# Altium schematic sheet DisplayPort.SchDoc
size A4; SheetNumber: 2; SheetTotal: 4
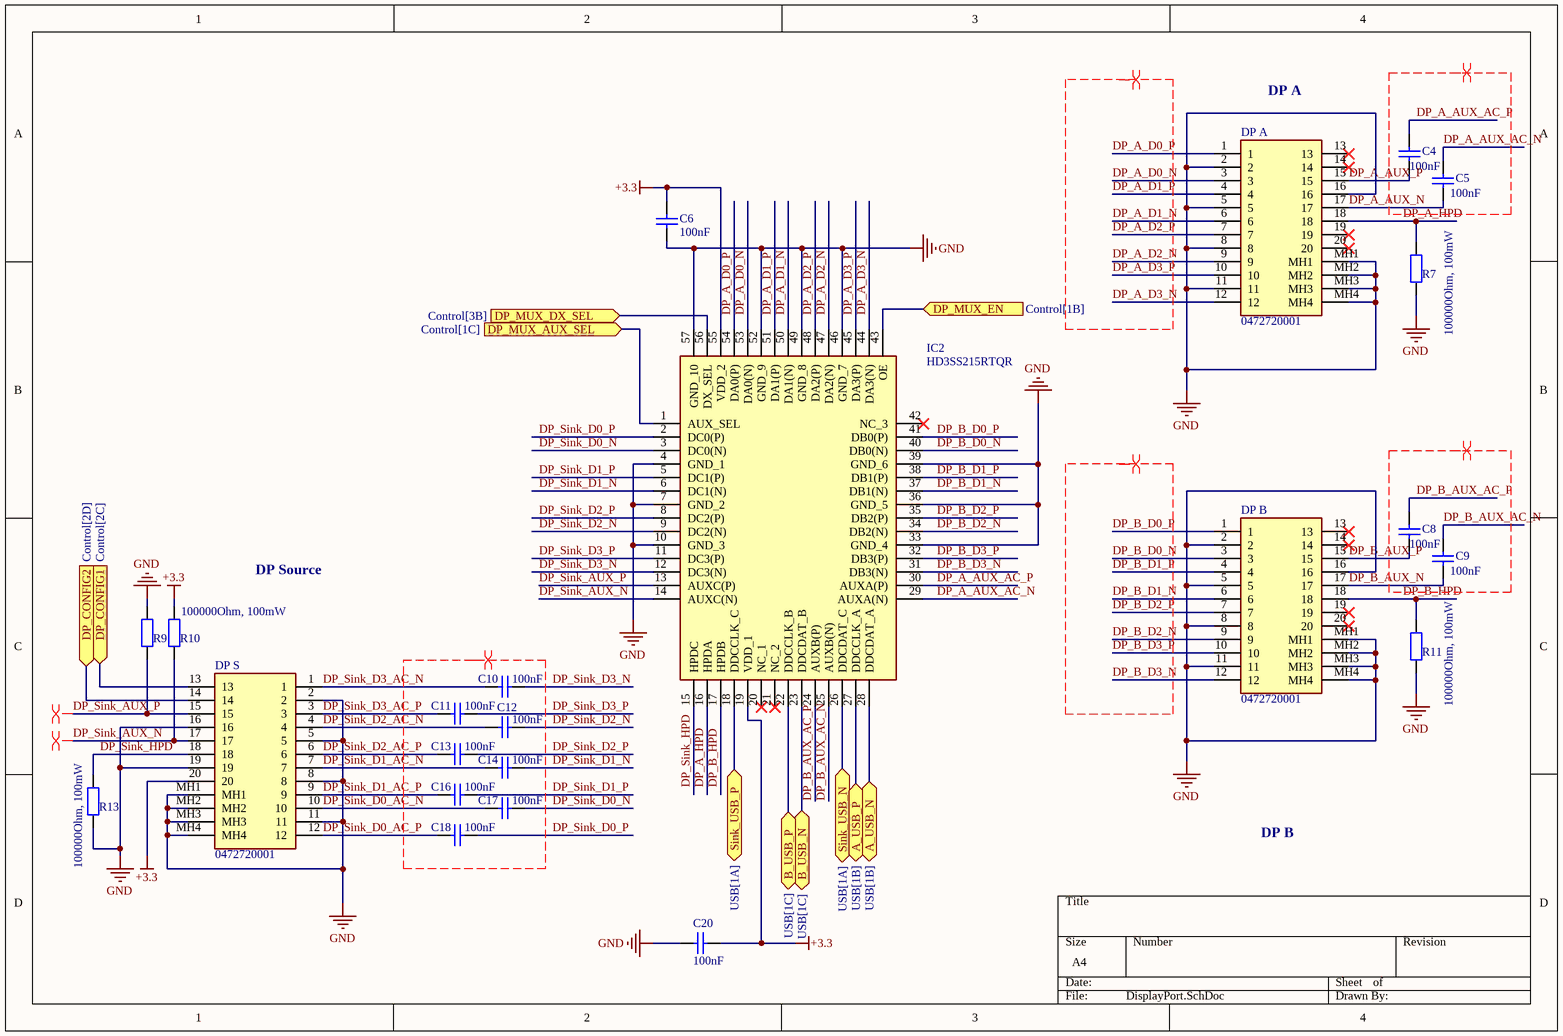
[diagram p0: DisplayPort.SchDoc]

## Parts
C4  Capacitance: 100nF  [WCAP-CSGP_0402_L1W0.5H0.5]  (hidden comment: 885012205037)
C5  Capacitance: 100nF  [WCAP-CSGP_0402_L1W0.5H0.5]  (hidden comment: 885012205037)
C6  Capacitance: 100nF  [WCAP-CSGP_0402_L1W0.5H0.5]  (hidden comment: 885012205037)
C8  Capacitance: 100nF  [WCAP-CSGP_0402_L1W0.5H0.5]  (hidden comment: 885012205037)
C9  Capacitance: 100nF  [WCAP-CSGP_0402_L1W0.5H0.5]  (hidden comment: 885012205037)
C10  Capacitance: 100nF  [WCAP-CSGP_0402_L1W0.5H0.5]  (hidden comment: 885012205037)
C11  Capacitance: 100nF  [WCAP-CSGP_0402_L1W0.5H0.5]  (hidden comment: 885012205037)
C12  Capacitance: 100nF  [WCAP-CSGP_0402_L1W0.5H0.5]  (hidden comment: 885012205037)
C13  Capacitance: 100nF  [WCAP-CSGP_0402_L1W0.5H0.5]  (hidden comment: 885012205037)
C14  Capacitance: 100nF  [WCAP-CSGP_0402_L1W0.5H0.5]  (hidden comment: 885012205037)
C16  Capacitance: 100nF  [WCAP-CSGP_0402_L1W0.5H0.5]  (hidden comment: 885012205037)
C17  Capacitance: 100nF  [WCAP-CSGP_0402_L1W0.5H0.5]  (hidden comment: 885012205037)
C18  Capacitance: 100nF  [WCAP-CSGP_0402_L1W0.5H0.5]  (hidden comment: 885012205037)
C20  Capacitance: 100nF  [WCAP-CSGP_0402_L1W0.5H0.5]  (hidden comment: 885012205037)
DP_A  0472720001  [0472720001]
DP_B  0472720001  [0472720001]
DP_S  0472720001  [0472720001]
IC2  HD3SS215RTQR  [QFN50P800X800X100-57N-D]
R7  100000Ohm, 100mW  [WRIS-RSKS_0402]
R9  100000Ohm, 100mW  [WRIS-RSKS_0402]  (value not drawn)
R10  100000Ohm, 100mW  [WRIS-RSKS_0402]
R11  100000Ohm, 100mW  [WRIS-RSKS_0402]
R13  100000Ohm, 100mW  [WRIS-RSKS_0402]

## Ports
A_USB_N (bidir, see USB[1B]), A_USB_P (bidir, see USB[1B]), B_USB_N (bidir, see USB[1C]), B_USB_P (bidir, see USB[1C]), DP_CONFIG1 (in, see Control[2C]), DP_CONFIG2 (in, see Control[2D]), DP_MUX_AUX_SEL (in, see Control[1C]), DP_MUX_DX_SEL (in, see Control[3B]), DP_MUX_EN (in, see Control[1B]), Sink_USB_N (bidir, see USB[1A]), Sink_USB_P (bidir, see USB[1A])

## Nets
+3.3: C6.1 C20.2 DP_S.20 IC2.19(VDD_1) IC2.55(VDD_2) R10.2
GND: C6.2 C20.1 DP_A.2 DP_A.5 DP_A.8 DP_A.11 DP_A.16 DP_A.MH1 DP_A.MH2 DP_A.MH3 DP_A.MH4 DP_B.2 DP_B.5 DP_B.8 DP_B.11 DP_B.16 DP_B.MH1 DP_B.MH2 DP_B.MH3 DP_B.MH4 DP_S.2 DP_S.5 DP_S.8 DP_S.11 DP_S.16 DP_S.19 DP_S.MH1 DP_S.MH2 DP_S.MH3 DP_S.MH4 IC2.4(GND_1) IC2.7(GND_2) IC2.10(GND_3) IC2.33(GND_4) IC2.36(GND_5) IC2.39(GND_6) IC2.46(GND_7) IC2.49(GND_8) IC2.52(GND_9) IC2.57(GND_10) R7.1 R9.2 R11.1 R13.1
A_USB_N: IC2.28(DDCDAT_A) ; port A_USB_N
A_USB_P: IC2.27(DDCCLK_A) ; port A_USB_P
B_USB_N: IC2.23(DDCDAT_B) ; port B_USB_N
B_USB_P: IC2.22(DDCCLK_B) ; port B_USB_P
DP_A_AUX_AC_N: C5.2 IC2.29(AUXA(N))
DP_A_AUX_AC_P: C4.2 IC2.30(AUXA(P))
DP_A_AUX_N: C5.1 DP_A.17
DP_A_AUX_P: C4.1 DP_A.15
DP_A_D0_N: DP_A.3 IC2.53(DA0(N))
DP_A_D0_P: DP_A.1 IC2.54(DA0(P))
DP_A_D1_N: DP_A.6 IC2.50(DA1(N))
DP_A_D1_P: DP_A.4 IC2.51(DA1(P))
DP_A_D2_N: DP_A.9 IC2.47(DA2(N))
DP_A_D2_P: DP_A.7 IC2.48(DA2(P))
DP_A_D3_N: DP_A.12 IC2.44(DA3(N))
DP_A_D3_P: DP_A.10 IC2.45(DA3(P))
DP_A_HPD: DP_A.18 IC2.16(HPDA) R7.2
DP_B_AUX_AC_N: C9.2 IC2.25(AUXB(N))
DP_B_AUX_AC_P: C8.2 IC2.24(AUXB(P))
DP_B_AUX_N: C9.1 DP_B.17
DP_B_AUX_P: C8.1 DP_B.15
DP_B_D0_N: DP_B.3 IC2.40(DB0(N))
DP_B_D0_P: DP_B.1 IC2.41(DB0(P))
DP_B_D1_N: DP_B.6 IC2.37(DB1(N))
DP_B_D1_P: DP_B.4 IC2.38(DB1(P))
DP_B_D2_N: DP_B.9 IC2.34(DB2(N))
DP_B_D2_P: DP_B.7 IC2.35(DB2(P))
DP_B_D3_N: DP_B.12 IC2.31(DB3(N))
DP_B_D3_P: DP_B.10 IC2.32(DB3(P))
DP_B_HPD: DP_B.18 IC2.17(HPDB) R11.2
DP_CONFIG1: DP_S.13 ; port DP_CONFIG1
DP_CONFIG2: DP_S.14 ; port DP_CONFIG2
DP_MUX_AUX_SEL: IC2.1(AUX_SEL) ; port DP_MUX_AUX_SEL
DP_MUX_DX_SEL: IC2.56(DX_SEL) ; port DP_MUX_DX_SEL
DP_MUX_EN: IC2.43(OE) ; port DP_MUX_EN
DP_Sink_AUX_N: DP_S.17 IC2.14(AUXC(N)) R10.1
DP_Sink_AUX_P: DP_S.15 IC2.13(AUXC(P)) R9.1
DP_Sink_D0_AC_N: C17.2 DP_S.10
DP_Sink_D0_AC_P: C18.2 DP_S.12
DP_Sink_D0_N: C17.1 IC2.3(DC0(N))
DP_Sink_D0_P: C18.1 IC2.2(DC0(P))
DP_Sink_D1_AC_N: C14.2 DP_S.7
DP_Sink_D1_AC_P: C16.2 DP_S.9
DP_Sink_D1_N: C14.1 IC2.6(DC1(N))
DP_Sink_D1_P: C16.1 IC2.5(DC1(P))
DP_Sink_D2_AC_N: C12.2 DP_S.4
DP_Sink_D2_AC_P: C13.2 DP_S.6
DP_Sink_D2_N: C12.1 IC2.9(DC2(N))
DP_Sink_D2_P: C13.1 IC2.8(DC2(P))
DP_Sink_D3_AC_N: C10.2 DP_S.1
DP_Sink_D3_AC_P: C11.2 DP_S.3
DP_Sink_D3_N: C10.1 IC2.12(DC3(N))
DP_Sink_D3_P: C11.1 IC2.11(DC3(P))
DP_Sink_HPD: DP_S.18 IC2.15(HPDC) R13.2
Sink_USB_N: IC2.26(DDCDAT_C) ; port Sink_USB_N
Sink_USB_P: IC2.18(DDCCLK_C) ; port Sink_USB_P

Not connected (* = marked no-connect by the designer): DP_A 13* 14* 19* 20*; DP_B 13* 14* 19* 20*; IC2 20(NC_1)* 21(NC_2)* 42(NC_3)*

## Layout directives
differential pair; differential pair class Z100: (no net found under the mark), DP_A_AUX_AC_N, DP_A_AUX_AC_P, DP_A_D0_N, DP_A_D0_P, DP_A_D1_N, DP_A_D1_P, DP_A_D2_N, DP_A_D2_P, DP_A_D3_N, DP_A_D3_P, DP_B_AUX_AC_N, DP_B_AUX_AC_P, DP_B_D0_N, DP_B_D0_P, DP_B_D1_N, DP_B_D1_P, DP_B_D2_N, DP_B_D2_P, DP_B_D3_N, DP_B_D3_P, DP_Sink_AUX_N, DP_Sink_AUX_P

## Notes on the sheet
- DP A
- DP Source
- DP B

## Library data of the parts
C4-C6 C8-C14 C16-C18 C20 = CMP-207839-000001-2: CAP CER 0.1UF 16V X7R 0402; NexarPartId: 53703175; Material: Ceramic; Tolerance: 10%; Insulation Resistance: 5GΩ; Dielectric: X7R; Case/Package: 0402; Voltage Rating (DC): 16V; Max Operating Temperature: 125°C; Width: 500µm; Packaging: Tape & Reel (TR); Height: 500µm; Min Operating Temperature: -55°C; REACH SVHC: Unknown; RoHS: Compliant; Thickness: 558.8µm; Mount: Surface Mount; Voltage Rating: 16V; Case Code (Imperial): 0402; Length: 1mm; Case Code (Metric): 1005
DP_A DP_B DP_S = 0472720001: Connector; Manufacturer_Name: Molex; Datasheet Link: http://www.molex.com/pdm_docs/sd/472720001_sd.pdf; Height: 6.9mm; Manufacturer_Part_Number: 0472720001; Mouser Part Number: N/A; Mouser Price/Stock: https://www.mouser.co.uk/ProductDetail/Molex/0472720001?qs=PBcRNPEHKsrarbeLf7n8sg%3D%3D; Arrow Part Number: 0472720001; Arrow Price/Stock: https://www.arrow.com/en/products/0472720001/molex?region=europe
IC2 = HD3SS215RTQR: Integrated Circuit; Manufacturer_Name: Texas Instruments; Datasheet Link: http://www.ti.com/lit/gpn/hd3ss215; Height: 1mm; Manufacturer_Part_Number: HD3SS215RTQR; Mouser Part Number: 595-HD3SS215RTQR; Mouser Price/Stock: https://www.mouser.co.uk/ProductDetail/Texas-Instruments/HD3SS215RTQR?qs=7z%252BmIopC6%2FI%2F794hSmEgIA%3D%3D; Arrow Part Number: HD3SS215RTQR; Arrow Price/Stock: https://www.arrow.com/en/products/hd3ss215rtqr/texas-instruments?region=nac
R7 R9-R11 R13 = 560112110019: WRIS-RSKS Thick Film Resistor, size 0402, 100000Ohm, 100mW; Manufacturer: Wurth Elektronik; Case/Size Code: 0402; Limiting Element Voltage: 50V; Resistance Tolerance: +/-1%; Temperature Coefficient of Resistance Min: -100ppm/°C; Temperature Coefficient of Resistance Max: 100ppm/°C; Manufacturer Part Number: 560112110019; Category: Thick Film Resistors; Match Code: WRIS-RSKS; ComponentLink1Description: Website Link; ComponentLink1URL: https://www.we-online.com/redexpert/article/560112110019?ad; ComponentLink2Description: Datasheet Link; ComponentLink2URL: https://www.we-online.com/redexpert/spec/560112110019?ad; Mount: Surface Mount; Operating Temperature Max: 155°C; Operating Temperature Min: -55°C; Packaging: Tape and Reel; Length: 1mm; Width: 0.5mm; Height: 0.35mm; Rated Power: 100mW; Resistance: 100000Ohm